# Altium schematic sheet TC_IC2.SchDoc
size A4; SheetNumber: 5; SheetTotal: 11
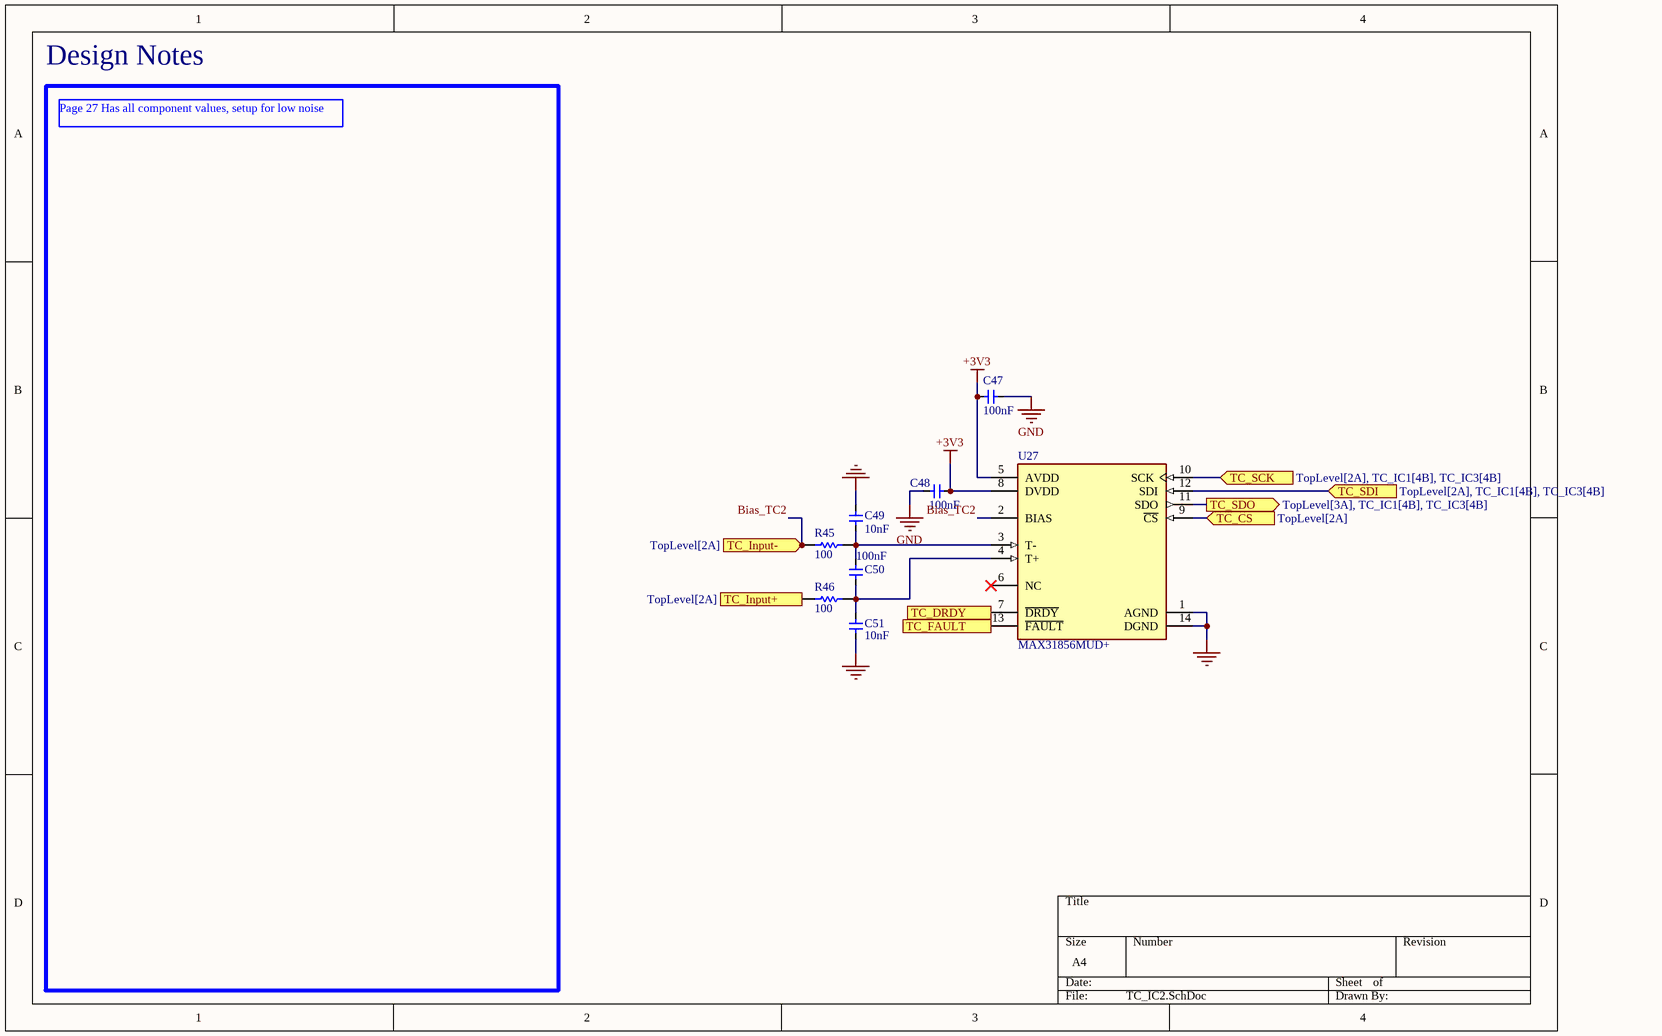
[diagram p0: TC_IC2.SchDoc]

## Parts
C47  value 100nF  [0.1uF-FP-CGA3E-0_3-0_1-IPC_A]  (hidden comment: CAP CER 0.1UF 25V 0603)
C48  value 100nF  [0.1uF-FP-CGA3E-0_3-0_1-IPC_A]  (hidden comment: CAP CER 0.1UF 25V 0603)
C49  value 10nF  [10000pF-CAP_1608_TDK]  (hidden comment: CGA3E2X7R1H103K080AA)
C50  value 100nF  [0.1uF-FP-CGA3E-0_3-0_1-IPC_A]  (hidden comment: CAP CER 0.1UF 25V 0603)
C51  value 10nF  [10000pF-CAP_1608_TDK]  (hidden comment: CGA3E2X7R1H103K080AA)
R45  value 100  [RESC1608X55X30LL15T15]  (hidden comment: ERJ-3EKF1000V)
R46  value 100  [RESC1608X55X30LL15T15]  (hidden comment: ERJ-3EKF1000V)
U27  MAX31856MUD+  [FP-U14-2-MFG]

## Ports
TC_CS (in, see TopLevel[2A]), TC_DRDY (out, see TopLevel[3A]), TC_FAULT (out, see TopLevel[3A]), TC_Input+ (in, see TopLevel[2A]), TC_Input- (in, see TopLevel[2A]), TC_SCK (in, see TopLevel[2A], TC_IC1[4B], TC_IC3[4B]), TC_SDI (in, see TopLevel[2A], TC_IC1[4B], TC_IC3[4B]), TC_SDO (out, see TopLevel[3A], TC_IC1[4B], TC_IC3[4B])

## Nets
+3V3: C47.1 C48.1 U27.5(AVDD) U27.8(DVDD)
GND: C47.2 C48.2 C49.1 C51.1 U27.1(AGND) U27.14(DGND)
Bias_TC2: R45.2 U27.2(BIAS) ; port TC_Input-
TC_CS: U27.9(~{CS}) ; port TC_CS
TC_DRDY: U27.7(~{DRDY}) ; port TC_DRDY
TC_FAULT: U27.13(~{FAULT}) ; port TC_FAULT
TC_Input+: R46.2 ; port TC_Input+
TC_SCK: U27.10(SCK) ; port TC_SCK
TC_SDI: U27.12(SDI) ; port TC_SDI
TC_SDO: U27.11(SDO) ; port TC_SDO
NetC49_2: C49.2 C50.2 R45.1 U27.3(T-)
NetC50_1: C50.1 C51.2 R46.1 U27.4(T+)

Not connected (* = marked no-connect by the designer): U27 6(NC)*

## Notes on the sheet
- Design Notes
- Page 27 Has all component values, setup for low noise

## Library data of the parts
C47 C48 C50 = CMP-001-00093-3: CGA3E2X7R1E104K080AA CAP CER 0.1UF 25V X7R 0603; Manufacturer: TDK Corporation; Tolerance: 10%; Voltage - Rated: 25V; Design Item ID: CGA3E2X7R1E104K080AA; ComponentLink1URL: https://product.tdk.com/info/en/catalog/spec/mlccspec_automotive_general_en.pdf; Thickness (Max): 0.035" (0.90mm); Operating Temperature: -55°C ~ 125°C; Mounting Type: Surface Mount, MLCC; Source: PlumBay_SchLib.SchLib; Size / Dimension: 0.063" L x 0.031" W (1.60mm x 0.80mm); Case/Package: 0603 (1608 Metric); ComponentLink1Description: Datasheet; Temperature Coefficient: X7R; Manufacturer Part Number: CGA3E2X7R1E104K080AA
C49 C51 = CMP-001-00094-1: CAP CER 10000PF 50V X7R 0603; Manufacturer: TDK Corporation; Tolerance: 10%; Voltage - Rated: 50V; Thickness (Max): 0.035" (0.90mm); ComponentLink1Description: Datasheet; Temperature Coefficient: X7R; Source: PlumBay_SchLib.SchLib; Operating Temperature: -55°C ~ 125°C; Case/Package: 0603 (1608 Metric); Mounting Type: Surface Mount, MLCC; Design Item ID: CGA3E2X7R1H103K080AA; Size / Dimension: 0.063" L x 0.031" W (1.60mm x 0.80mm); Manufacturer Part Number: CGA3E2X7R1H103K080AA; ComponentLink1URL: https://product.tdk.com/info/en/catalog/spec/mlccspec_automotive_general_en.pdf
R45 R46 = CMP-009-00194-1: Fixed Resistor, Metal Glaze/thick Film, 0.1W, 100ohm, 75V, 1% +/-Tol, 100ppm/Cel, Surface Mount, 0603; Power: 100mW; Pins: 2; Tolerance: 1%; RoHS Compliant: Yes; Case/Package: 0603; Min Operating Temperature: -55°C; Max Operating Temperature: 155°C; Mounting Technology: Surface Mount
U27 = CMP-015-00011-1: Analog Circuit, 1 Func, PDSO14; Max Supply Voltage: 3.6V; Min Supply Voltage: 3V; Nominal Supply Voltage: 3.3V; Pins: 14; Min Operating Temperature: -55°C; Case/Package: TSSOP; RoHS Compliant: Yes; Max Operating Temperature: 125°C